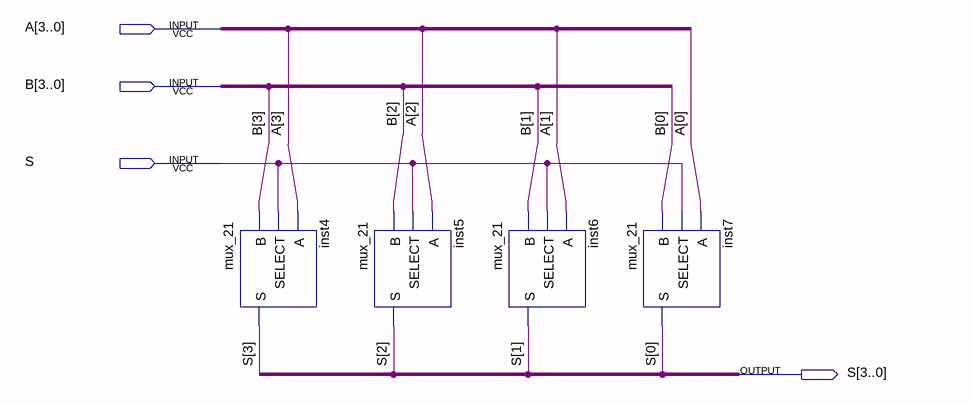
[diagram p0: schematic sheet]
// Quartus schematic mux_21_4b.bdf as structural Verilog: 4 symbols, 4 pins
module mux_21_4b (
  input  [3:0] A,
  input  [3:0] B,
  input  S_1bit,
  output [3:0] S
);

  mux_21 inst4 (.B(B[3]), .SELECT(S_1bit), .A(A[3]), .S(S[3]));
  mux_21 inst5 (.B(B[2]), .SELECT(S_1bit), .A(A[2]), .S(S[2]));
  mux_21 inst6 (.B(B[1]), .SELECT(S_1bit), .A(A[1]), .S(S[1]));
  mux_21 inst7 (.B(B[0]), .SELECT(S_1bit), .A(A[0]), .S(S[0]));
endmodule
